# EAGLE schematic EN2-EP2 (EAGLE 6.6.0)
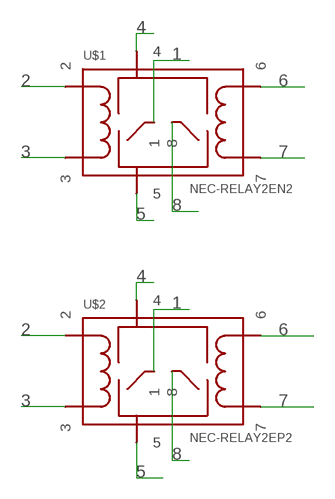
[diagram p0: schematic, sheet 1]

## Parts
U$1  NEC-RELAY2EN2  [NEC-EN2]
U$2  NEC-RELAY2EP2  [NEC-EP2]

## Nets
1: U$1.P$1 U$2.P$1
2: U$1.P$2 U$2.P$2
3: U$1.P$3 U$2.P$3
4: U$1.P$4 U$2.P$4
5: U$1.P$5 U$2.P$5
6: U$1.P$6 U$2.P$6
7: U$1.P$7 U$2.P$7
8: U$1.P$8 U$2.P$8

## Library data of the parts
U$1 U$2 = PCR-Switch:NEC-RELAY2